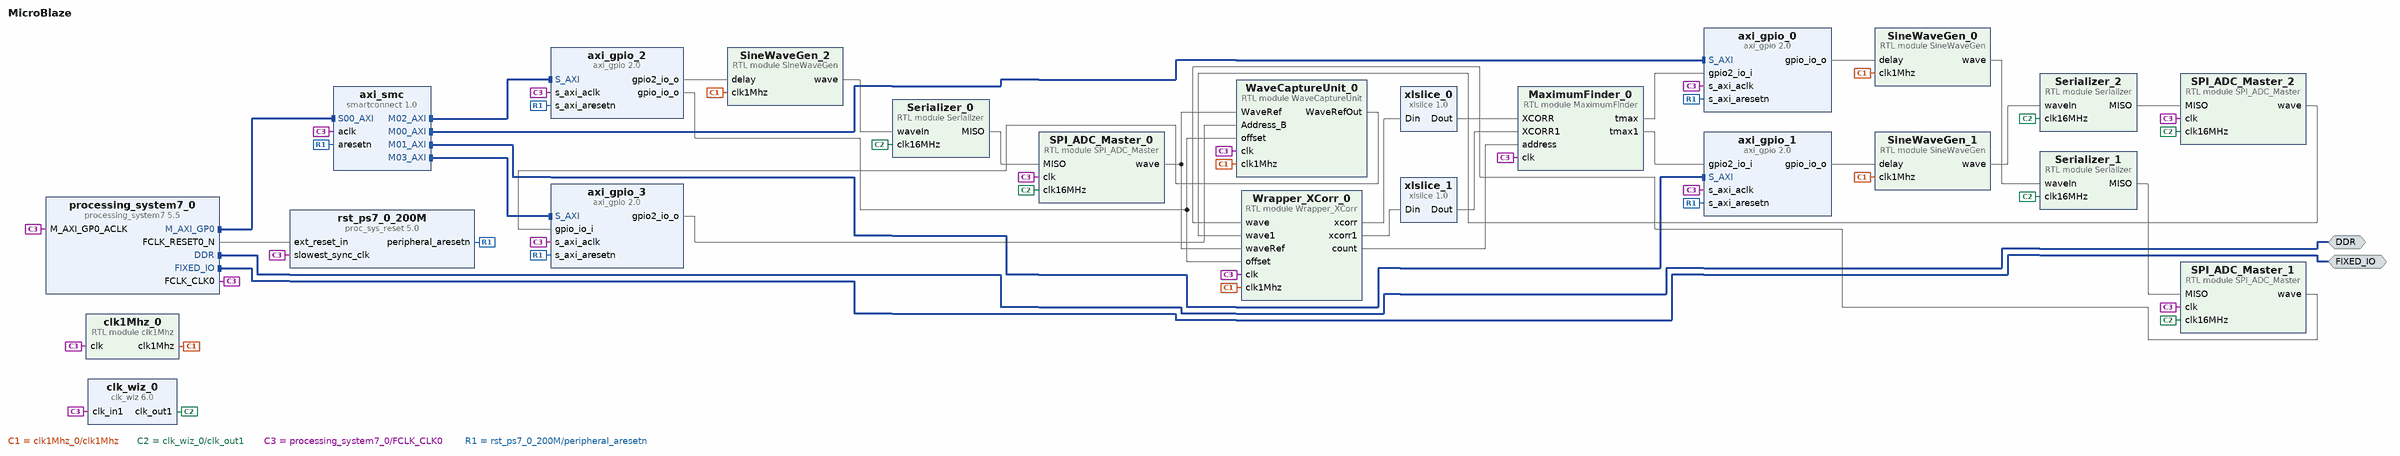
[diagram p0: block diagram of the top level]
# Vivado block design MicroBlaze, xc7z020clg400-1, Vivado 2024.2
create_bd_design MicroBlaze

create_bd_intf_port -mode Master -vlnv xilinx.com:interface:ddrx_rtl:1.0 DDR
create_bd_intf_port -mode Master -vlnv xilinx.com:display_processing_system7:fixedio_rtl:1.0 FIXED_IO

create_bd_cell -type ip -vlnv xilinx.com:ip:axi_gpio:2.0 axi_gpio_0
set_property -dict {CONFIG.C_ALL_INPUTS_2 1 CONFIG.C_ALL_OUTPUTS 1 CONFIG.C_IS_DUAL 1} [get_bd_cells axi_gpio_0]
create_bd_cell -type ip -vlnv xilinx.com:ip:axi_gpio:2.0 axi_gpio_1
set_property -dict {CONFIG.C_ALL_INPUTS_2 1 CONFIG.C_ALL_OUTPUTS 1 CONFIG.C_IS_DUAL 1} [get_bd_cells axi_gpio_1]
create_bd_cell -type module -reference SineWaveGen SineWaveGen_0
create_bd_cell -type ip -vlnv xilinx.com:ip:clk_wiz:6.0 clk_wiz_0
set_property -dict [list \
  CONFIG.CLKIN1_JITTER_PS 50.0 \
  CONFIG.CLKOUT1_JITTER 162.321 \
  CONFIG.CLKOUT1_PHASE_ERROR 89.971 \
  CONFIG.CLKOUT1_REQUESTED_OUT_FREQ 16 \
  CONFIG.MMCM_CLKFBOUT_MULT_F 5.000 \
  CONFIG.MMCM_CLKIN1_PERIOD 5.000 \
  CONFIG.MMCM_CLKIN2_PERIOD 10.0 \
  CONFIG.MMCM_CLKOUT0_DIVIDE_F 62.500 \
  CONFIG.USE_LOCKED false \
  CONFIG.USE_RESET false \
] [get_bd_cells clk_wiz_0]
create_bd_cell -type module -reference SPI_ADC_Master SPI_ADC_Master_0
create_bd_cell -type module -reference Serializer Serializer_0
create_bd_cell -type module -reference SPI_ADC_Master SPI_ADC_Master_1
create_bd_cell -type module -reference Serializer Serializer_1
create_bd_cell -type module -reference SPI_ADC_Master SPI_ADC_Master_2
create_bd_cell -type module -reference Serializer Serializer_2
create_bd_cell -type module -reference clk1Mhz clk1Mhz_0
create_bd_cell -type module -reference MaximumFinder MaximumFinder_0
create_bd_cell -type module -reference SineWaveGen SineWaveGen_1
create_bd_cell -type ip -vlnv xilinx.com:ip:xlslice:1.0 xlslice_0
set_property -dict {CONFIG.DIN_FROM 35 CONFIG.DIN_TO 4 CONFIG.DIN_WIDTH 36 CONFIG.DOUT_WIDTH 32} [get_bd_cells xlslice_0]
create_bd_cell -type ip -vlnv xilinx.com:ip:xlslice:1.0 xlslice_1
set_property -dict {CONFIG.DIN_FROM 35 CONFIG.DIN_TO 4 CONFIG.DIN_WIDTH 36 CONFIG.DOUT_WIDTH 32} [get_bd_cells xlslice_1]
create_bd_cell -type module -reference Wrapper_XCorr Wrapper_XCorr_0
create_bd_cell -type module -reference SineWaveGen SineWaveGen_2
create_bd_cell -type ip -vlnv xilinx.com:ip:axi_gpio:2.0 axi_gpio_2
set_property -dict [list \
  CONFIG.C_ALL_OUTPUTS 1 \
  CONFIG.C_ALL_OUTPUTS_2 1 \
  CONFIG.C_DOUT_DEFAULT 0x00000000 \
  CONFIG.C_GPIO_WIDTH 32 \
  CONFIG.C_IS_DUAL 1 \
  CONFIG.GPIO_BOARD_INTERFACE Custom \
  CONFIG.USE_BOARD_FLOW true \
] [get_bd_cells axi_gpio_2]
create_bd_cell -type module -reference WaveCaptureUnit WaveCaptureUnit_0
create_bd_cell -type ip -vlnv xilinx.com:ip:axi_gpio:2.0 axi_gpio_3
set_property -dict {CONFIG.C_ALL_INPUTS 1 CONFIG.C_ALL_OUTPUTS_2 1 CONFIG.C_IS_DUAL 1} [get_bd_cells axi_gpio_3]
create_bd_cell -type ip -vlnv xilinx.com:ip:processing_system7:5.5 processing_system7_0
set_property -dict [list \
  CONFIG.PCW_APU_PERIPHERAL_FREQMHZ 666.666666 \
  CONFIG.PCW_CAN0_CAN0_IO {MIO 14 .. 15} \
  CONFIG.PCW_CAN0_PERIPHERAL_ENABLE 1 \
  CONFIG.PCW_ENET0_ENET0_IO {MIO 16 .. 27} \
  CONFIG.PCW_ENET0_GRP_MDIO_ENABLE 1 \
  CONFIG.PCW_ENET0_GRP_MDIO_IO {MIO 52 .. 53} \
  CONFIG.PCW_ENET0_PERIPHERAL_CLKSRC {ARM PLL} \
  CONFIG.PCW_ENET0_PERIPHERAL_ENABLE 1 \
  CONFIG.PCW_ENET0_RESET_ENABLE 0 \
  CONFIG.PCW_ENET_RESET_ENABLE 1 \
  CONFIG.PCW_ENET_RESET_SELECT {Share reset pin} \
  CONFIG.PCW_FPGA0_PERIPHERAL_FREQMHZ 200 \
  CONFIG.PCW_FPGA1_PERIPHERAL_FREQMHZ 50 \
  CONFIG.PCW_GPIO_MIO_GPIO_ENABLE 1 \
  CONFIG.PCW_GPIO_MIO_GPIO_IO MIO \
  CONFIG.PCW_GPIO_PERIPHERAL_ENABLE 1 \
  CONFIG.PCW_I2C0_I2C0_IO EMIO \
  CONFIG.PCW_I2C0_PERIPHERAL_ENABLE 1 \
  CONFIG.PCW_I2C1_I2C1_IO {MIO 12 .. 13} \
  CONFIG.PCW_I2C1_PERIPHERAL_ENABLE 1 \
  CONFIG.PCW_I2C_PERIPHERAL_FREQMHZ 83.333336 \
  CONFIG.PCW_I2C_RESET_ENABLE 1 \
  CONFIG.PCW_I2C_RESET_SELECT {Share reset pin} \
  CONFIG.PCW_PRESET_BANK1_VOLTAGE {LVCMOS 1.8V} \
  CONFIG.PCW_QSPI_GRP_FBCLK_ENABLE 1 \
  CONFIG.PCW_QSPI_GRP_FBCLK_IO {MIO 8} \
  CONFIG.PCW_QSPI_GRP_SINGLE_SS_ENABLE 1 \
  CONFIG.PCW_QSPI_GRP_SINGLE_SS_IO {MIO 1 .. 6} \
  CONFIG.PCW_QSPI_PERIPHERAL_ENABLE 1 \
  CONFIG.PCW_QSPI_QSPI_IO {MIO 1 .. 6} \
  CONFIG.PCW_SD0_GRP_CD_ENABLE 1 \
  CONFIG.PCW_SD0_GRP_CD_IO {MIO 46} \
  CONFIG.PCW_SD0_GRP_WP_ENABLE 1 \
  CONFIG.PCW_SD0_GRP_WP_IO {MIO 47} \
  CONFIG.PCW_SD0_PERIPHERAL_ENABLE 1 \
  CONFIG.PCW_SD0_SD0_IO {MIO 40 .. 45} \
  CONFIG.PCW_SDIO_PERIPHERAL_FREQMHZ 100 \
  CONFIG.PCW_SINGLE_QSPI_DATA_MODE x4 \
  CONFIG.PCW_UART1_PERIPHERAL_ENABLE 1 \
  CONFIG.PCW_UART1_UART1_IO {MIO 48 .. 49} \
  CONFIG.PCW_UART_PERIPHERAL_FREQMHZ 100 \
  CONFIG.PCW_UIPARAM_DDR_PARTNO {MT41J256M16 RE-125} \
  CONFIG.PCW_USB0_PERIPHERAL_ENABLE 1 \
  CONFIG.PCW_USB0_RESET_ENABLE 1 \
  CONFIG.PCW_USB0_RESET_IO {MIO 51} \
  CONFIG.PCW_USB0_USB0_IO {MIO 28 .. 39} \
  CONFIG.PCW_USB_RESET_ENABLE 1 \
  CONFIG.PCW_USB_RESET_SELECT {Share reset pin} \
] [get_bd_cells processing_system7_0]
# 286 more settings of processing_system7_0 are not shown: defaults, MIO pin electricals, DDR timing, and values the tool derives
create_bd_cell -type ip -vlnv xilinx.com:ip:smartconnect:1.0 axi_smc
set_property -dict {CONFIG.NUM_MI 4 CONFIG.NUM_SI 1} [get_bd_cells axi_smc]
create_bd_cell -type ip -vlnv xilinx.com:ip:proc_sys_reset:5.0 rst_ps7_0_200M

# ---- connections ----

connect_bd_intf_net [get_bd_intf_pins axi_smc/M00_AXI] [get_bd_intf_pins axi_gpio_0/S_AXI]
connect_bd_intf_net [get_bd_intf_pins axi_smc/M01_AXI] [get_bd_intf_pins axi_gpio_1/S_AXI]
connect_bd_intf_net [get_bd_intf_pins axi_smc/M02_AXI] [get_bd_intf_pins axi_gpio_2/S_AXI]
connect_bd_intf_net [get_bd_intf_pins axi_smc/M03_AXI] [get_bd_intf_pins axi_gpio_3/S_AXI]
connect_bd_intf_net [get_bd_intf_ports DDR] [get_bd_intf_pins processing_system7_0/DDR]
connect_bd_intf_net [get_bd_intf_ports FIXED_IO] [get_bd_intf_pins processing_system7_0/FIXED_IO]
connect_bd_intf_net [get_bd_intf_pins processing_system7_0/M_AXI_GP0] [get_bd_intf_pins axi_smc/S00_AXI]
connect_bd_net [get_bd_pins MaximumFinder_0/tmax] [get_bd_pins axi_gpio_0/gpio2_io_i]
connect_bd_net [get_bd_pins MaximumFinder_0/tmax1] [get_bd_pins axi_gpio_1/gpio2_io_i]
connect_bd_net [get_bd_pins clk1Mhz_0/clk1Mhz] \
  [get_bd_pins SineWaveGen_0/clk1Mhz] [get_bd_pins SineWaveGen_1/clk1Mhz] [get_bd_pins SineWaveGen_2/clk1Mhz] \
  [get_bd_pins WaveCaptureUnit_0/clk1Mhz] [get_bd_pins Wrapper_XCorr_0/clk1Mhz]
connect_bd_net [get_bd_pins SPI_ADC_Master_0/wave] [get_bd_pins WaveCaptureUnit_0/WaveRef] [get_bd_pins Wrapper_XCorr_0/waveRef]
connect_bd_net [get_bd_pins SPI_ADC_Master_1/wave] [get_bd_pins Wrapper_XCorr_0/wave]
connect_bd_net [get_bd_pins SPI_ADC_Master_2/wave] [get_bd_pins Wrapper_XCorr_0/wave1]
connect_bd_net [get_bd_pins Serializer_0/MISO] [get_bd_pins SPI_ADC_Master_0/MISO]
connect_bd_net [get_bd_pins Serializer_1/MISO] [get_bd_pins SPI_ADC_Master_1/MISO]
connect_bd_net [get_bd_pins Serializer_2/MISO] [get_bd_pins SPI_ADC_Master_2/MISO]
connect_bd_net [get_bd_pins SineWaveGen_0/wave] [get_bd_pins Serializer_1/waveIn]
connect_bd_net [get_bd_pins SineWaveGen_1/wave] [get_bd_pins Serializer_2/waveIn]
connect_bd_net [get_bd_pins SineWaveGen_2/wave] [get_bd_pins Serializer_0/waveIn]
connect_bd_net [get_bd_pins WaveCaptureUnit_0/WaveRefOut] [get_bd_pins axi_gpio_3/gpio_io_i]
connect_bd_net [get_bd_pins Wrapper_XCorr_0/count] [get_bd_pins MaximumFinder_0/address]
connect_bd_net [get_bd_pins Wrapper_XCorr_0/xcorr] [get_bd_pins xlslice_0/Din]
connect_bd_net [get_bd_pins Wrapper_XCorr_0/xcorr1] [get_bd_pins xlslice_1/Din]
connect_bd_net [get_bd_pins axi_gpio_0/gpio_io_o] [get_bd_pins SineWaveGen_0/delay]
connect_bd_net [get_bd_pins axi_gpio_1/gpio_io_o] [get_bd_pins SineWaveGen_1/delay]
connect_bd_net [get_bd_pins axi_gpio_2/gpio2_io_o] [get_bd_pins SineWaveGen_2/delay]
connect_bd_net [get_bd_pins axi_gpio_2/gpio_io_o] [get_bd_pins WaveCaptureUnit_0/offset] [get_bd_pins Wrapper_XCorr_0/offset]
connect_bd_net [get_bd_pins axi_gpio_3/gpio2_io_o] [get_bd_pins WaveCaptureUnit_0/Address_B]
connect_bd_net [get_bd_pins clk_wiz_0/clk_out1] \
  [get_bd_pins SPI_ADC_Master_0/clk16MHz] [get_bd_pins SPI_ADC_Master_1/clk16MHz] [get_bd_pins SPI_ADC_Master_2/clk16MHz] \
  [get_bd_pins Serializer_0/clk16MHz] [get_bd_pins Serializer_1/clk16MHz] [get_bd_pins Serializer_2/clk16MHz]
connect_bd_net [get_bd_pins processing_system7_0/FCLK_CLK0] \
  [get_bd_pins processing_system7_0/M_AXI_GP0_ACLK] [get_bd_pins axi_gpio_0/s_axi_aclk] [get_bd_pins axi_gpio_1/s_axi_aclk] \
  [get_bd_pins axi_gpio_2/s_axi_aclk] [get_bd_pins axi_gpio_3/s_axi_aclk] [get_bd_pins clk_wiz_0/clk_in1] \
  [get_bd_pins MaximumFinder_0/clk] [get_bd_pins SPI_ADC_Master_0/clk] [get_bd_pins SPI_ADC_Master_1/clk] \
  [get_bd_pins SPI_ADC_Master_2/clk] [get_bd_pins WaveCaptureUnit_0/clk] [get_bd_pins Wrapper_XCorr_0/clk] \
  [get_bd_pins clk1Mhz_0/clk] [get_bd_pins axi_smc/aclk] [get_bd_pins rst_ps7_0_200M/slowest_sync_clk]
connect_bd_net [get_bd_pins processing_system7_0/FCLK_RESET0_N] [get_bd_pins rst_ps7_0_200M/ext_reset_in]
connect_bd_net [get_bd_pins rst_ps7_0_200M/peripheral_aresetn] \
  [get_bd_pins axi_gpio_0/s_axi_aresetn] [get_bd_pins axi_gpio_1/s_axi_aresetn] [get_bd_pins axi_gpio_2/s_axi_aresetn] \
  [get_bd_pins axi_gpio_3/s_axi_aresetn] [get_bd_pins axi_smc/aresetn]
connect_bd_net [get_bd_pins xlslice_0/Dout] [get_bd_pins MaximumFinder_0/XCORR]
connect_bd_net [get_bd_pins xlslice_1/Dout] [get_bd_pins MaximumFinder_0/XCORR1]

# ---- address map ----
assign_bd_address -offset 0x41200000 -range 64K -target_address_space [get_bd_addr_spaces processing_system7_0/Data] [get_bd_addr_segs axi_gpio_0/S_AXI/Reg]
assign_bd_address -offset 0x41210000 -range 64K -target_address_space [get_bd_addr_spaces processing_system7_0/Data] [get_bd_addr_segs axi_gpio_1/S_AXI/Reg]
assign_bd_address -offset 0x41220000 -range 64K -target_address_space [get_bd_addr_spaces processing_system7_0/Data] [get_bd_addr_segs axi_gpio_2/S_AXI/Reg]
assign_bd_address -offset 0x41230000 -range 64K -target_address_space [get_bd_addr_spaces processing_system7_0/Data] [get_bd_addr_segs axi_gpio_3/S_AXI/Reg]

validate_bd_design
save_bd_design
